# Altium schematic sheet PWM_OUTS.SchDoc
size Letter
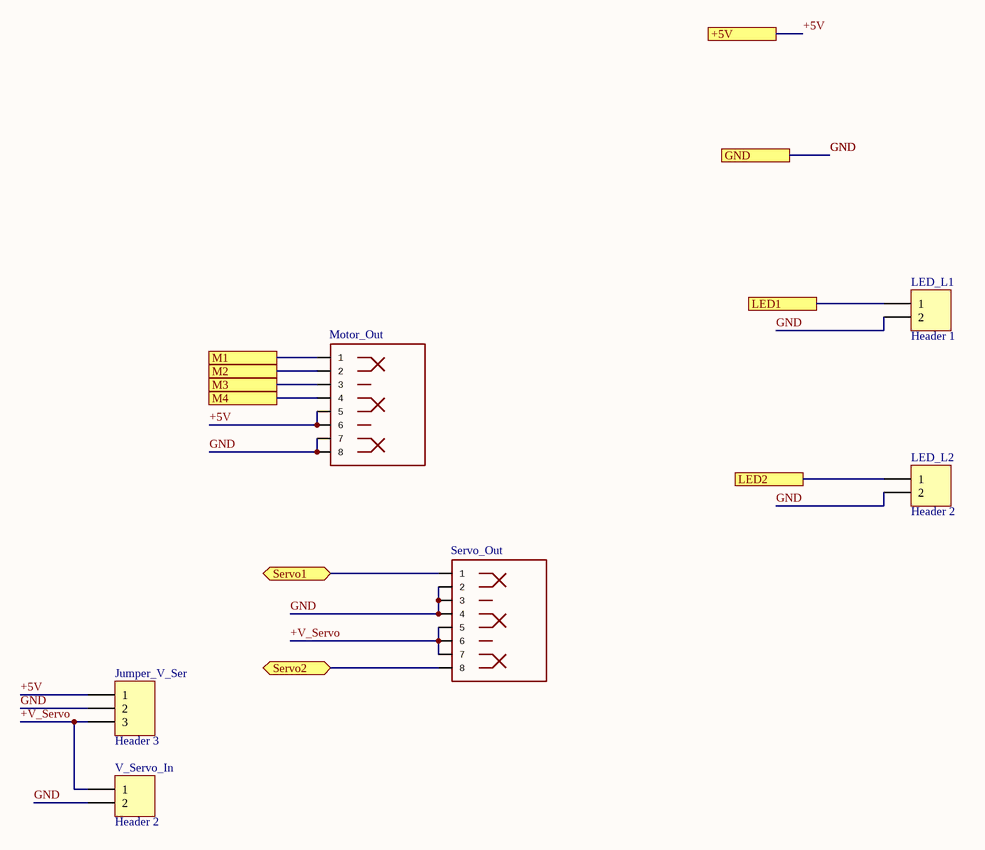
[diagram p0: PWM_OUTS.SchDoc]

## Parts
Jumper_V_Ser  Header 3  [HDR1X3]
LED_L1  Header 1  [HDR1X2]
LED_L2  Header 2  [HDR1X2]
Motor_Out  (no value)  [RJ45-8]
Servo_Out  (no value)  [RJ45-8]
V_Servo_In  Header 2  [HDR1X2]

## Ports
+5V, GND, LED1, LED2, M1, M2, M3, M4, Servo1, Servo2

## Nets
+5V: Jumper_V_Ser.1 Motor_Out.5 Motor_Out.6 ; port +5V
+V_Servo: Jumper_V_Ser.3 Servo_Out.5 Servo_Out.6 Servo_Out.7 V_Servo_In.1
GND: Jumper_V_Ser.2 LED_L1.2 LED_L2.2 Motor_Out.7 Motor_Out.8 Servo_Out.2 Servo_Out.3 Servo_Out.4 V_Servo_In.2 ; port GND
LED1: LED_L1.1 ; port LED1
LED2: LED_L2.1 ; port LED2
M1: Motor_Out.1 ; port M1
M2: Motor_Out.2 ; port M2
M3: Motor_Out.3 ; port M3
M4: Motor_Out.4 ; port M4
Servo1: Servo_Out.1 ; port Servo1
Servo2: Servo_Out.8 ; port Servo2

## Library data of the parts
Jumper_V_Ser = Header 3: Header, 3-Pin; LatestRevisionDate: 17-Jul-2002; LatestRevisionNote: Re-released for DXP Platform.; Publisher: Altium Limited
LED_L1 LED_L2 V_Servo_In = Header 2: Header, 2-Pin; LatestRevisionDate: 17-Jul-2002; LatestRevisionNote: Re-released for DXP Platform.; Publisher: Altium Limited
Motor_Out Servo_Out = RJ45-8PTH: PROD_ID: CONN-08506